# Altium schematic sheet Altimeter.SchDoc
size B; SheetNumber: 5; SheetTotal: 8
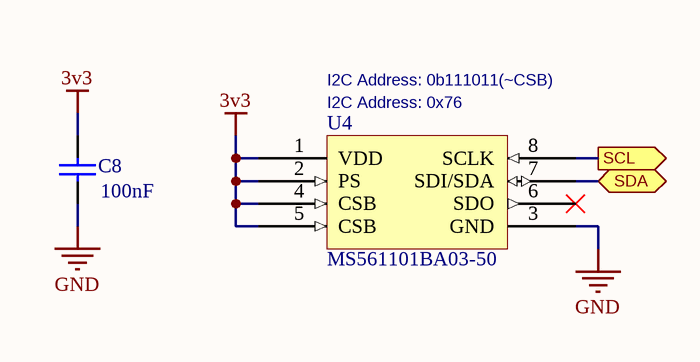
[diagram p0: Altimeter.SchDoc]

## Parts
C8  Capacitance: 100nF  [Capacitor_0402]  (hidden comment: GRM155R71E104KE14D)
U4  MS561101BA03-50  [MS561101BA03-50-Footprint-1]

## Ports
SCL (out), SDA (bidir)

## Nets
3v3: C8.2 U4.1(VDD) U4.2(PS) U4.4(CSB) U4.5(CSB)
GND: C8.1 U4.3(GND)
SCL: U4.8(SCLK) ; port SCL
SDA: U4.7(SDI/SDA) ; port SDA

Not connected (* = marked no-connect by the designer): U4 6(SDO)*

## Notes on the sheet
- (near U4) I2C Address: 0b111011(~CSB)
- (near U4) I2C Address: 0x76

## Library data of the parts
C8 = CMP-001-00084-3: Chip Capacitor 100nF 0402 25V X7R
U4 = CMP-010-00029-1: Pressure Sensor 1.44V to 3.6V 0.01bar to 1.2bar Absolute 8-Pin QFN T/R